# EAGLE design geikoBoard (EAGLE 7.6.0)
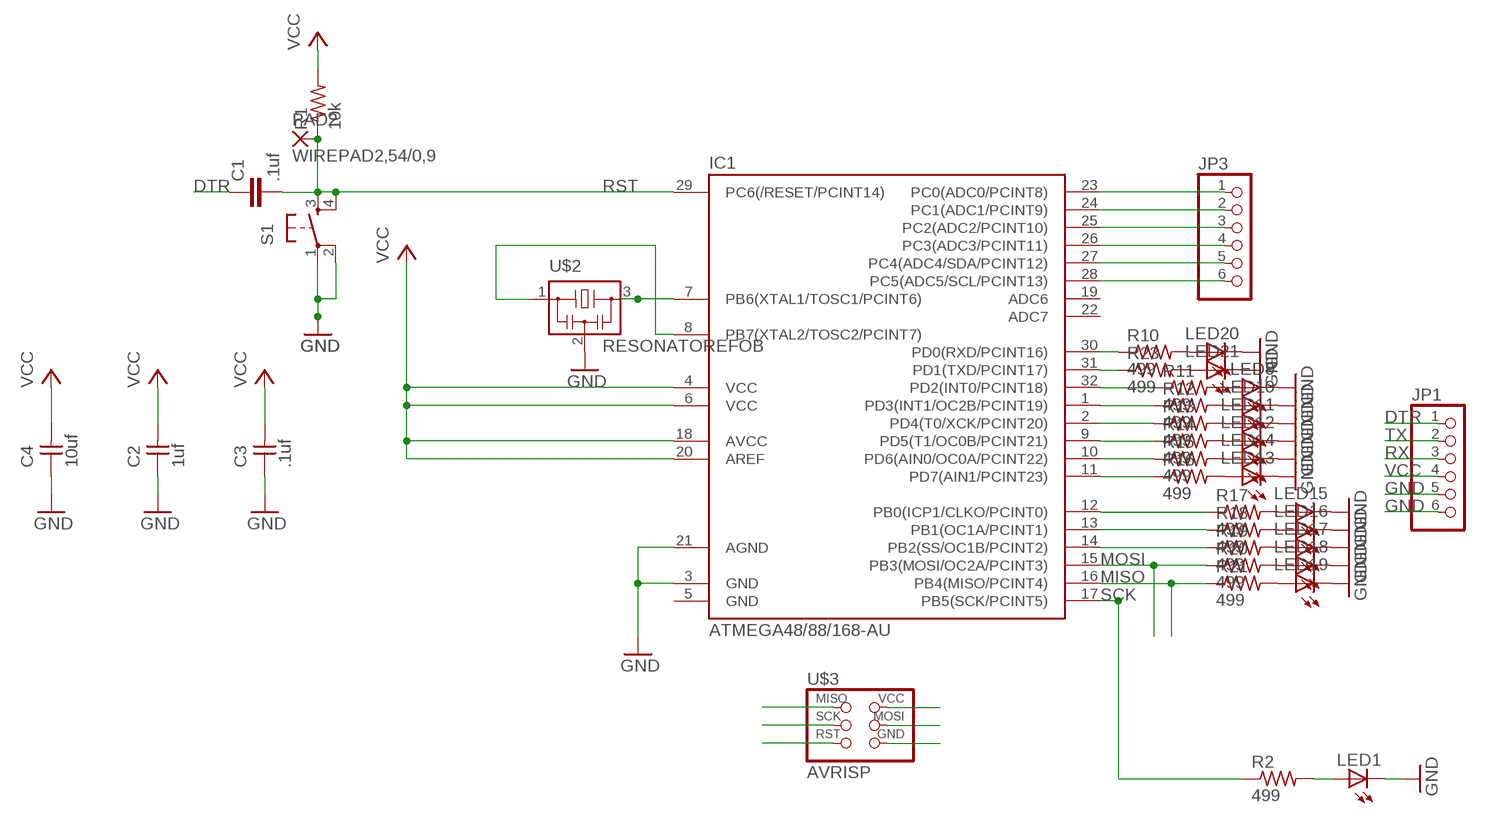
[diagram p0: schematic, sheet 1]

## Parts
C1  .1uf  C-EUC1206  [C1206]
C2  1uf  UNPOLARIZED_CAPACITOR1206  [1206]
C3  .1uf  UNPOLARIZED_CAPACITOR1206  [1206]
C4  10uf  UNPOLARIZED_CAPACITOR1206  [1206]
IC1  ATMEGA48/88/168-AU  [TQFP32-08]
JP1  PINHD-1X6  [1X06]
JP3  PINHD-1X6  [1X06]
LED1  LED5MM  [LED5MM]
LED9  LED1206  [1206]
LED10  LED1206  [1206]
LED11  LED1206  [1206]
LED12  LED1206  [1206]
LED13  LED1206  [1206]
LED14  LED1206  [1206]
LED15  LED1206  [1206]
LED16  LED1206  [1206]
LED17  LED1206  [1206]
LED18  LED1206  [1206]
LED19  LED1206  [1206]
LED20  LED1206  [1206]
LED21  LED1206  [1206]
PAD2  WIREPAD2,54/0,9  [2,54/0,9]
R1  10k  RESISTOR1206  [1206]
R2  499  RESISTOR1206  [1206]
R10  499  RESISTOR1206  [1206]
R11  499  RESISTOR1206  [1206]
R12  499  RESISTOR1206  [1206]
R13  499  RESISTOR1206  [1206]
R14  499  RESISTOR1206  [1206]
R15  499  RESISTOR1206  [1206]
R16  499  RESISTOR1206  [1206]
R17  499  RESISTOR1206  [1206]
R18  499  RESISTOR1206  [1206]
R19  499  RESISTOR1206  [1206]
R20  499  RESISTOR1206  [1206]
R21  499  RESISTOR1206  [1206]
R23  499  RESISTOR1206  [1206]
S1  6MM_SWITCH6MM_SWITCH  [6MM_SWITCH]
U$2  RESONATOREFOB  [EFOBM]
U$3  AVRISP  [2X03]

## Nets
DTR: C1.1 JP1.1
GND: C2.1 C3.1 C4.1 IC1.3(GND) IC1.21(AGND) JP1.5 JP1.6 LED1.K(C) LED9.2(C) LED10.2(C) LED11.2(C) LED12.2(C) LED13.2(C) LED14.2(C) LED15.2(C) LED16.2(C) LED17.2(C) LED18.2(C) LED19.2(C) LED20.2(C) LED21.2(C) S1.1(P) S1.2(P1) U$2.2 U$3.6(GND)
MISO: IC1.16(PB4(MISO/PCINT4)) R21.1 U$3.1(MISO)
MOSI: IC1.15(PB3(MOSI/OC2A/PCINT3)) R20.1 U$3.4(MOSI)
N$1: IC1.8(PB7(XTAL2/TOSC2/PCINT7)) U$2.1
N$2: IC1.12(PB0(ICP1/CLKO/PCINT0)) R17.1
N$3: IC1.23(PC0(ADC0/PCINT8)) JP3.1
N$4: IC1.24(PC1(ADC1/PCINT9)) JP3.2
N$5: IC1.25(PC2(ADC2/PCINT10)) JP3.3
N$6: IC1.26(PC3(ADC3/PCINT11)) JP3.4
N$7: IC1.27(PC4(ADC4/SDA/PCINT12)) JP3.5
N$8: IC1.28(PC5(ADC5/SCL/PCINT13)) JP3.6
N$9: IC1.7(PB6(XTAL1/TOSC1/PCINT6)) U$2.3
N$10: IC1.32(PD2(INT0/PCINT18)) R11.1
N$11: IC1.1(PD3(INT1/OC2B/PCINT19)) R12.1
N$12: IC1.2(PD4(T0/XCK/PCINT20)) R13.1
N$13: IC1.9(PD5(T1/OC0B/PCINT21)) R14.1
N$14: IC1.10(PD6(AIN0/OC0A/PCINT22)) R15.1
N$15: IC1.11(PD7(AIN1/PCINT23)) R16.1
N$17: IC1.13(PB1(OC1A/PCINT1)) R18.1
N$18: IC1.14(PB2(SS/OC1B/PCINT2)) R19.1
N$19: LED9.1(A) R11.2
N$20: LED10.1(A) R12.2
N$21: LED11.1(A) R13.2
N$22: LED12.1(A) R14.2
N$23: LED1.A R2.2
N$24: LED13.1(A) R16.2
N$25: LED14.1(A) R15.2
N$26: LED15.1(A) R17.2
N$27: LED16.1(A) R18.2
N$28: LED17.1(A) R19.2
N$29: LED18.1(A) R20.2
N$30: LED19.1(A) R21.2
N$38: LED20.1(A) R10.2
N$39: LED21.1(A) R23.2
RST: C1.2 IC1.29(PC6(/RESET/PCINT14)) PAD2.1(P) R1.1 S1.3(S) S1.4(S1) U$3.5(RST)
RX: IC1.30(PD0(RXD/PCINT16)) JP1.3 R10.1
SCK: IC1.17(PB5(SCK/PCINT5)) R2.1 U$3.3(SCK)
TX: IC1.31(PD1(TXD/PCINT17)) JP1.2 R23.1
VCC: C2.2 C3.2 C4.2 IC1.4(VCC) IC1.6(VCC) IC1.18(AVCC) IC1.20(AREF) JP1.4 R1.2 U$3.2(VCC)
Unconnected: IC1.19(ADC6) IC1.22(ADC7)

## Power pins joined to a net without a drawn wire
GND: IC1.5(GND)

## Library data of the parts
C1 = rcl:C-EU: CAPACITOR, European symbol
C2-C4 = ng:UNPOLARIZED_CAPACITOR: unpolarized_capacitor
IC1 = atmega8:ATMEGA48/88/168
JP1 JP3 = pinhead:PINHD-1X6: PIN HEADER
LED1 = led:LED: LED OSRAM: - CHIPLED LG R971, LG N971, LY N971, LG Q971, LY Q971, LO R971, LY R971 LH N974, LH R974 LS Q976, LO Q976, LY Q976 LO Q996 - Hyper CHIPLED LW Q18S LB Q993, LB Q99A, LB R99A - SideLED LS A670, LO A670, LY A670, LG A670, LP A670 LB A673, LV A673, LT A673, LW A673 LH A674 LY A675 LS A676, LA A676, LO A676, LY A676, LW A676 LS A679, LY A679, LG A679 - Hyper Micro SIDELED® LS Y876, LA Y876, LO Y876, LY Y876 LT Y87S - SmartLED LW L88C, LW L88S LB L89C, LB L89S, LG L890 LS L89K, LO L89K, LY L89K LS L896, LA L896, LO L896, LY L896 - TOPLED LS T670, LO T670, LY T670, LG T670, LP T670 LSG T670, LSP T670, LSY T670, LOP T670, LYG T670 LG T671, LOG T671, LSG T671 LB T673, LV T673, LT T673, LW T673 LH T674 LS T676, LA T676, LO T676, LY T676, LB T676, LH T676, LSB T676, LW T676 LB T67C, LV T67C, LT T67C, LS T67K, LO T67K, LY T67K, LW E67C LS E67B, LA E67B, LO E67B, LY E67B, LB E67C, LV E67C, LT E67C LW T67C LS T679, LY T679, LG T679 LS T770, LO T770, LY T770, LG T770, LP T770 LB T773, LV T773, LT T773, LW T773 LH T774 LS E675, LA E675, LY E675, LS T675 LS T776, LA T776, LO T776, LY T776, LB T776 LHGB T686 LT T68C, LB T68C - Hyper Mini TOPLED® LB M676 - Mini TOPLED Santana® LG M470 LS M47K, LO M47K, LY M47K Source: http://www.osram.convergy.de LUXEON: - LUMILED® LXK2-PW12-R00, LXK2-PW12-S00, LXK2-PW14-U00, LXK2-PW14-V00 LXK2-PM12-R00, LXK2-PM12-S00, LXK2-PM14-U00 LXK2-PE12-Q00, LXK2-PE12-R00, LXK2-PE12-S00, LXK2-PE14-T00, LXK2-PE14-U00 LXK2-PB12-K00, LXK2-PB12-L00, LXK2-PB12-M00, LXK2-PB14-N00, LXK2-PB14-P00, LXK2-PB14-Q00 LXK2-PR12-L00, LXK2-PR12-M00, LXK2-PR14-Q00, LXK2-PR14-R00 LXK2-PD12-Q00, LXK2-PD12-R00, LXK2-PD12-S00 LXK2-PH12-R00, LXK2-PH12-S00 LXK2-PL12-P00, LXK2-PL12-Q00, LXK2-PL12-R00 Source: www.luxeon.com KINGBRIGHT: KA-3528ASYC Source: www.kingbright.com
LED9-LED21 = ng:LED
PAD2 = wirepad:WIREPAD: Wire PAD connect wire on PCB
R1 R2 R10-R21 R23 = ng:RESISTOR
S1 = ng:6MM_SWITCH: OMRON SWITCH
U$2 = fab:RESONATOR
U$3 = fab:AVRISP

## Board
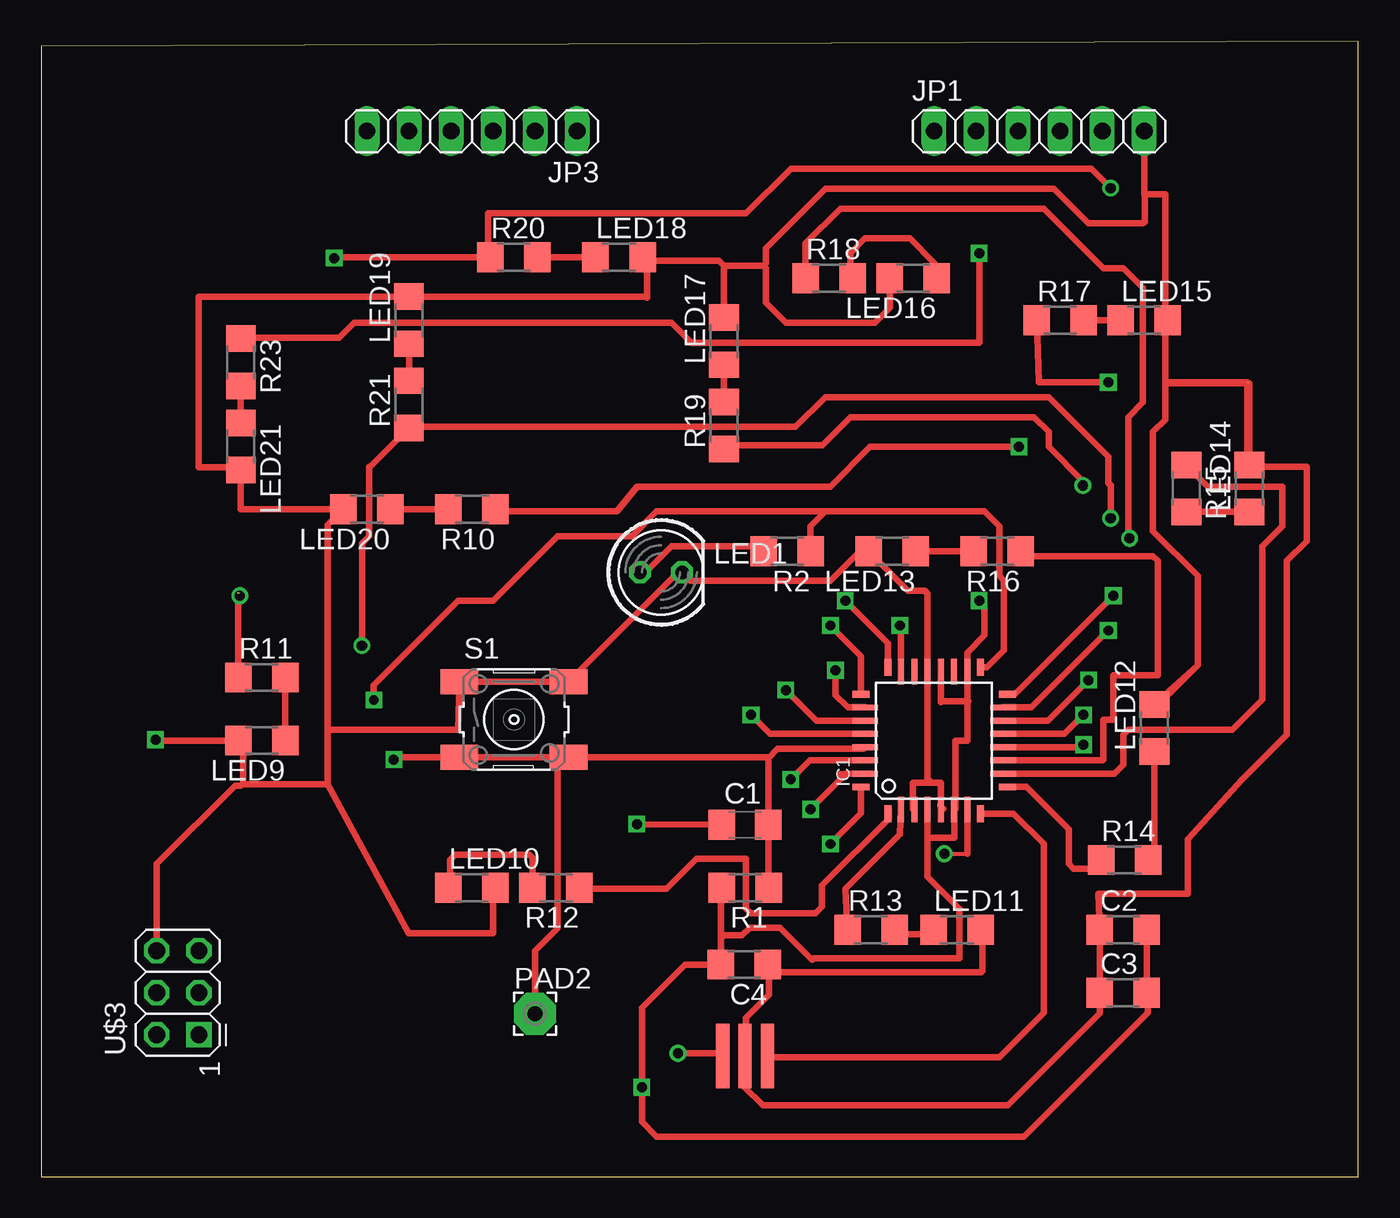
[diagram p1: board, top side]
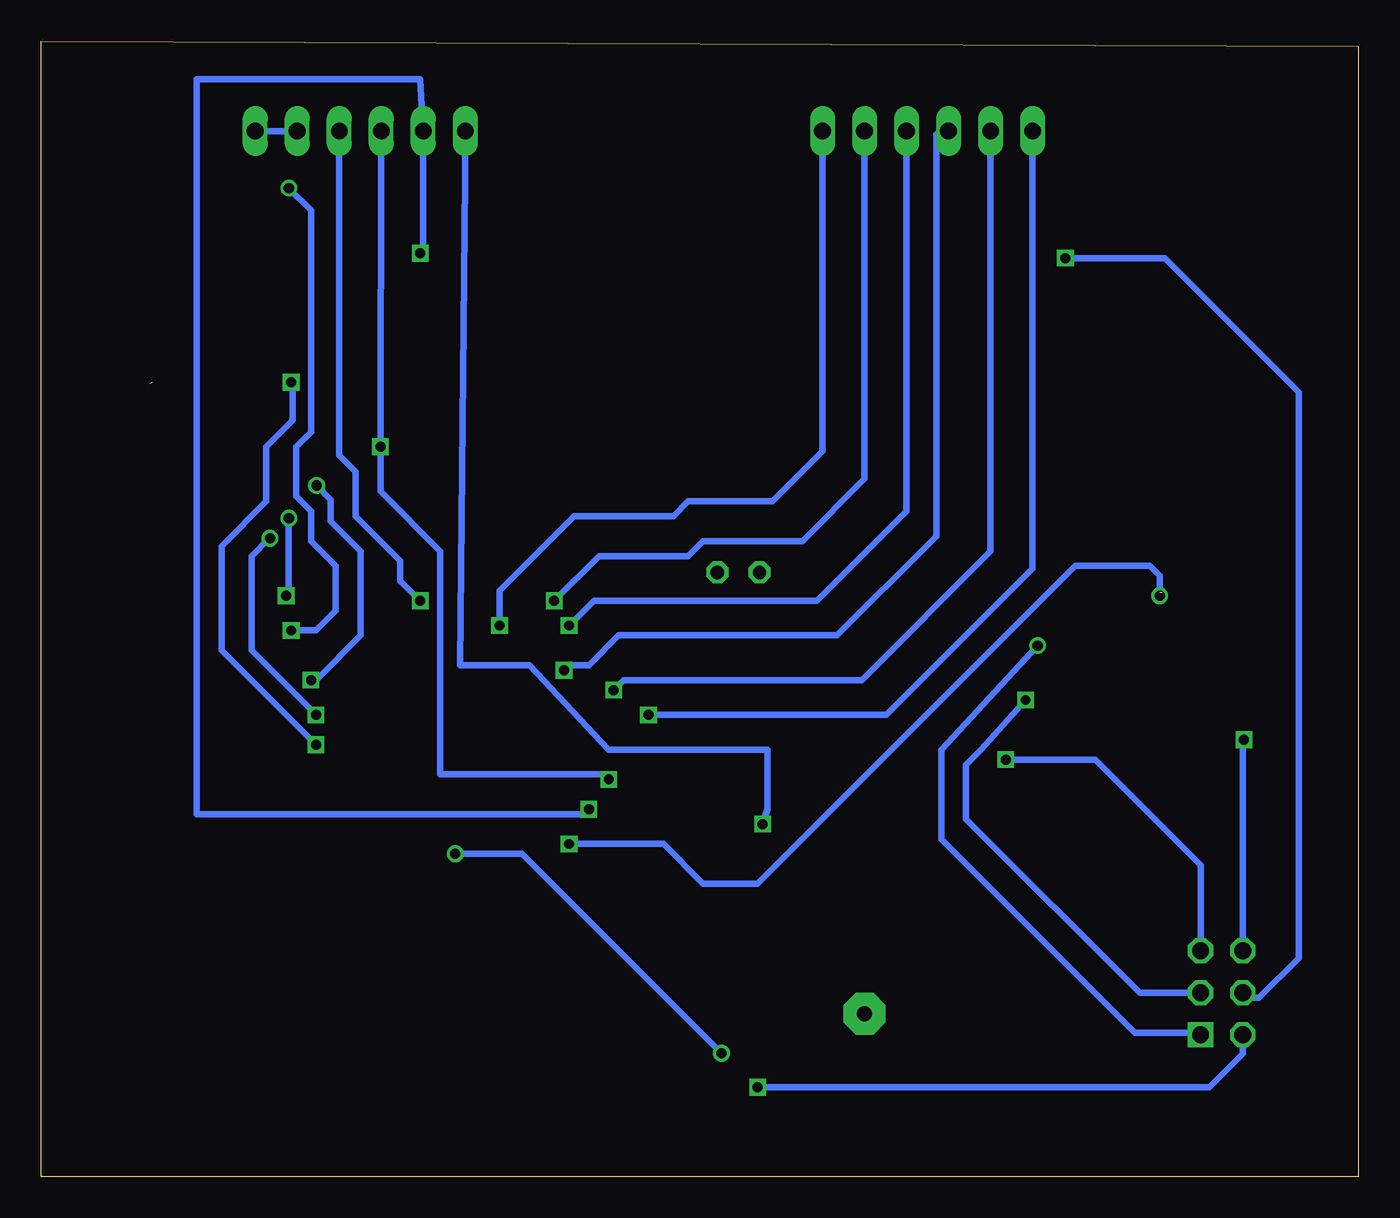
[diagram p2: board, bottom side, seen from below]

Size 79.6 x 68.6 mm. Coordinates in mm from the lower left corner, seen from the top.
Outline: 0,0 79.6,0 79.6,68.6 0,68.3 0,0
Copper layers (1*16): Top 0.035mm / dielectric 1.5mm / Bottom 0.035mm
Design rules "default": minimum track width 10mil, minimum drill 24mil, track to track 8mil, track to pad 8mil, pad to pad 8mil, via to via 8mil, smd to smd 8mil, copper to edge 40mil, drill to drill 8mil, minimum pad ring 10mil, minimum via ring 8mil, stop-mask expansion 4mil, vias tented up to drill 0mil, thermal gap 10mil

### Footprints (pad centres in the part's own frame; a part is rotated, then mirrored left to right if it is on the bottom)
C1206 = smd 1.6 x 1.8: 1 -1.4,0; 2 1.4,0
1206 = smd 1.6 x 1.803: 1 -1.422,0; 2 1.422,0
TQFP32-08 = smd 1.016 x 0.406: 1 -4.42,2.8; 8 -4.42,-2.8; 17 4.42,-2.8; 24 4.42,2.8 | smd 1.524 x 0.356: 2 -4.166,2; 3 -4.166,1.2; 4 -4.166,0.4; 5 -4.166,-0.4; 6 -4.166,-1.2; 7 -4.166,-2; 18 4.166,-2; 19 4.166,-1.2; 20 4.166,-0.4; 21 4.166,0.4; 22 4.166,1.2; 23 4.166,2 | smd 0.406 x 1.016: 9 -2.8,-4.42; 16 2.8,-4.42; 25 2.8,4.42; 32 -2.8,4.42 | smd 0.356 x 1.524: 10 -2,-4.166; 11 -1.2,-4.166; 12 -0.4,-4.166; 13 0.4,-4.166; 14 1.2,-4.166; 15 2,-4.166; 26 2,4.166; 27 1.2,4.166; 28 0.4,4.166; 29 -0.4,4.166; 30 -1.2,4.166; 31 -2,4.166
1X06 = drill 1.016 long: 1 -6.35,0; 2 -3.81,0; 3 -1.27,0; 4 1.27,0; 5 3.81,0; 6 6.35,0
LED5MM = drill 0.813 octagon: A -1.27,0; K 1.27,0
2,54/0,9 = drill 0.914 pad 2.54 octagon: 1 0,0
6MM_SWITCH = smd 2.286 x 1.524: 1 -3.302,2.286; 2 3.302,2.286; 3 -3.302,-2.286; 4 3.302,-2.286
EFOBM = smd 0.8 x 3.9: 1 -1.35,0; 2 0,0; 3 1.35,0
2X03 = drill 1.016 square: 1 -2.54,-1.27 | drill 1.016 octagon: 2 -2.54,1.27; 3 0,-1.27; 4 0,1.27; 5 2.54,-1.27; 6 2.54,1.27

### Placement (x,y rotation side)
C1  42.54,21.27 0 top
C2  65.4,14.92 0 top
C3  65.4,11.11 0 top
C4  42.48,12.82 180 top
IC1  53.97,26.35 90 top
JP1  60.32,63.18 0 top
JP3  26.03,63.18 180 top
LED1  37.46,36.51 0 top
LED9  13.33,26.35 180 top
LED10  26.03,17.46 0 top
LED11  55.35,14.91 0 top
LED12  67.27,27.12 90 top
LED13  51.43,37.78 180 top
LED14  73.02,41.59 90 top
LED15  66.67,51.75 0 top
LED16  52.7,54.29 180 top
LED17  41.27,50.48 90 top
LED18  34.92,55.56 0 top
LED19  22.22,51.75 90 top
LED20  19.68,40.32 180 top
LED21  12.06,44.13 270 top
PAD2  29.84,9.84 0 top
R1  42.54,17.46 180 top
R2  45.08,37.78 180 top
R10  26.03,40.32 180 top
R11  13.33,30.16 0 top
R12  31.11,17.46 180 top
R13  50.16,14.92 0 top
R14  65.47,19.13 0 top
R15  69.21,41.59 270 top
R16  57.78,37.78 180 top
R17  61.59,51.75 0 top
R18  47.62,54.29 0 top
R19  41.27,45.4 90 top
R20  28.57,55.56 0 top
R21  22.22,46.67 90 top
R23  12.06,49.21 270 top
S1  28.57,27.62 0 top
U$2  42.54,7.3 180 top
U$3  8.25,11.11 90 top

### Tracks (layer width: path | path; a pad name or v marks a point on that pad's centre or on a via)
DTR  (via drill 0.6)
  Top 0.406: C1.1 v36,21.3
  Bottom 0.406: JP1.1 54.3,30.9 50.1,30.9 45.3,25.8 35.7,25.8 35.7,22.2 v36,21.3
GND  (1 unrouted)
  Top 0.254: 7.03,13.8 U$3.6 | 12.06,23.63 12.2,23.7 | 66.7,59.29 66.7,59.37
  Top 0.406: 6.98,26.35 LED9.2 | IC1.3 52.7,22.18 52.7,23.81 53.83,23.81 | 53.83,23.81 54.37,23.81 IC1.5 54.48,22.18 54.52,22.23 54.48,22.23 54.39,22.13 54.39,22.36 | LED14.2 73.02,47.94 67.94,47.94 | 67.94,47.94 67.94,51.6 LED15.2 67.94,51.75 67.94,59.37 66.7,59.37 66.67,59.37 JP1.6 | C3.1 C2.1 | C2.1 64.13,14.92 | 54.39,22.36 54.34,22.41 54.34,22.45 | C4.1 43.9,12.42 43.99,12.33 | 43.99,12.33 56.83,12.33 56.9,12.4 56.9,14.78 LED11.2 56.49,14.91 56.4,15 | 17.32,27 17.32,23.7 | 17.32,23.7 12.2,23.7 12.2,26.06 LED9.2 | 11.63,26.07 LED9.2 | C2.1 63.98,9.86 58.42,4.3 43.62,4.3 42.48,5.44 42.48,7.24 U$2.2 42.6,7.36 42.6,9.6 43.99,10.99 43.99,12.33 | 53.83,23.81 53.57,24.07 IC1.21 53.57,35.23 53.4,35.4 52.39,35.4 LED13.2 50.01,37.67 49.94,37.6 49.3,37.6 47.7,36 39.24,36 LED1.K 38.48,36.51 S1.2 S1.1 25.2,27 17.32,27 | LED17.2 41.27,55.04 | 41.27,55.04 40.96,55.35 36.55,55.35 LED18.2 36.6,55.3 36.6,53.1 36.53,53.17 LED19.2 9.52,53.17 9.52,42.86 12.06,42.86 LED21.2 12.06,40.32 LED20.2 17.32,39.38 17.32,27 | 41.27,55.04 43.64,55.04 | 43.64,55.04 43.66,55.04 43.8,54.9 43.8,52.8 45,51.6 50.4,51.6 51.3,52.5 51.3,54.27 LED16.2 | 69.9,30.9 67.54,28.54 LED12.2 69.9,30.9 | 69.9,30.9 69.9,36.3 67.2,39 67.2,45 67.94,45.74 67.94,47.94 | 54.39,22.36 54.39,23.61 54.3,23.7 | 68.1,48 72.9,48 72.9,42.9 76.5,42.9 76.5,38.4 75.3,37.2 75.3,26.7 72.6,24 69.3,20.4 69.3,17.1 63.9,17.1 C2.1 | 17.32,23.7 22.2,14.7 27.3,14.7 27.3,17.31 LED10.2 | 66.7,59.29 66.7,57.7 66.6,57.6 63.3,57.6 61.2,59.7 47.41,59.7 44.11,56.4 44.1,56.4 43.8,56.1 43.8,55.2 43.64,55.04 | 12.06,23.63 11.71,23.63 6.98,18.9 U$3.6
  Bottom 0.406: JP1.6 JP1.5 64.13,62.67 64.2,62.6 | U$3.6 6.98,26.13 7.2,26.35 6.98,26.35
MISO  (via drill 0.6, 0.61)
  Top 0.254: 22.12,45.12 R21.1
  Top 0.406: IC1.16 58.85,29.15 v64.8,35.1 | v19.38,32.09 19.38,38.27 19.8,38.7 19.8,42.9 19.87,42.9 R21.1 22.27,45.3 45.6,45.3 47.4,47.1 60.9,47.1 64.5,43.5 64.5,41.9 64.64,41.76 v64.64,39.79
  Bottom 0.254: 9.32,8.77 U$3.1 | 64.64,35.29 v64.8,35.1
  Bottom 0.406: v19.38,32.09 25.2,25.8 25.2,20.4 13.5,8.7 9.65,8.7 U$3.1 | v64.64,39.79 64.64,35.26 v64.8,35.1
MOSI  (via drill 0.6, 0.61)
  Top 0.406: IC1.15 59.85,28.35 v64.5,33 | v17.7,55.5 17.76,55.56 R20.1 27,55.71 27,58.2 42.6,58.2 45.3,60.9 63.48,60.9 v64.64,59.74
  Bottom 0.254: 63.27,45.01 63.59,44.69 | 64.41,33.01 v64.5,33
  Bottom 0.406: v17.7,55.5 11.7,55.5 3.6,47.4 3.6,13.2 6,10.8 6.67,10.8 U$3.4 | 64.41,33.01 63,33.01 61.8,34.2 61.8,36.9 63.3,38.4 63.3,40.2 64.2,41.1 64.2,44.1 63.61,44.69 63.59,44.69 63.3,44.97 63.3,58.4 v64.64,59.74
N$1
  Top 0.406: 43.81,7.3 U$2.1 43.99,7.2 57.9,7.2 60.6,9.9 60.6,20.1 58.77,21.93 IC1.8
N$2  (via drill 0.6)
  Top 0.406: IC1.12 62.85,25.95 v63,26.1 | R17.1 60.3,48 v64.5,48
  Bottom 0.254: 63.04,26.15 v63,26.1 | 64.41,47.86 v64.5,48
  Bottom 0.406: 64.41,47.86 64.41,45.69 66,44.1 66,40.8 68.7,38.1 68.7,31.8 v63,26.1
N$3  (via drill 0.6)
  Top 0.406: IC1.23 51.97,33.23 v51.9,33.3
  Bottom 0.406: JP3.1 32.38,43.82 35.4,40.8 40.5,40.8 41.4,39.9 47.4,39.9 51.9,35.4 v51.9,33.3
N$4  (via drill 0.6)
  Top 0.406: IC1.24 51.17,32.23 v48.6,34.8
  Bottom 0.406: JP3.2 29.84,42.16 33.6,38.4 39.6,38.4 40.5,37.5 45.9,37.5 v48.6,34.8
N$5  (via drill 0.6)
  Top 0.406: IC1.25 49.55,31.45 v47.7,33.3
  Bottom 0.406: JP3.3 27.3,40.2 32.7,34.8 46.2,34.8 v47.7,33.3
N$6  (via drill 0.6)
  Top 0.406: IC1.26 48.75,28.35 48,29.1 v48,30.6
  Bottom 0.406: JP3.4 25.32,63.18 25.5,63 25.5,38.7 25.8,38.4 31.5,32.7 44.7,32.7 46.5,30.9 47.7,30.9 v48,30.6
N$7  (via drill 0.6)
  Top 0.406: IC1.27 46.85,27.55 v45,29.4
  Bottom 0.406: JP3.5 22.22,37.78 30,30 44.4,30 v45,29.4
N$8  (via drill 0.6)
  Top 0.406: IC1.28 44.05,26.75 v42.9,27.9
  Bottom 0.406: JP3.6 19.68,36.72 28.5,27.9 v42.9,27.9 43.05,27.75
N$9  (via drill 0.61)
  Top 0.254: v54.58,19.52 55.97,19.52
  Top 0.406: IC1.7 55.97,19.52 | v38.48,7.45 41.05,7.45 U$2.3
  Bottom 0.406: v38.48,7.45 50.55,19.52 v54.58,19.52
N$10  (via drill 0.6)  (2 unrouted)
  Top 0.406: IC1.32 49.55,21.95 v47.7,20.1 | R11.1 11.91,35.2 12,35.29
  Bottom 0.406: v47.7,20.1 42,20.1 39.6,17.7 36.3,17.7 17.1,36.9 12.6,36.9 12,36.3 12,35.29
N$11
  Top 0.406: IC1.1 51.17,22.09 51.24,22.16 51.24,21.64 47.2,17.6 47.2,16.3 46.8,15.9 42.9,15.9 42.6,16.2 42.6,19.2 39.6,19.2 37.8,17.4 32.59,17.4 R12.1
N$12
  Top 0.406: R13.1 48.6,17.4 51.9,20.7 IC1.2
N$13
  Top 0.406: IC1.9 59.55,23.55 62.1,21 62.1,18.9 62.4,18.6 63.52,18.6 R14.1
N$14
  Top 0.406: IC1.10 64.85,24.35 65.4,24.9 65.4,26.7 65.7,27 72,27 73.8,28.8 73.8,38.1 75,39.3 75,41.7 70.52,41.7 R15.1
N$15
  Top 0.406: IC1.11 64.15,25.15 64.2,25.2 64.2,27.6 64.8,27.6 64.8,30.3 67.5,30.3 67.5,37.2 67.2,37.5 59.48,37.5 R16.1
N$17  (via drill 0.6, 0.61)
  Top 0.406: IC1.13 61.85,26.75 v63,27.9 | R18.1 46.2,56.1 46.2,56.4 48.3,58.5 60.6,58.5 64.2,54.9 65.4,54.9 66.6,53.7 66.6,46.8 65.7,45.9 65.7,38.66 v65.78,38.58
  Bottom 0.254: 65.78,30.72 63.04,27.98 v63,27.9
  Bottom 0.406: v65.78,38.58 65.82,38.58 66.9,37.5 66.9,31.8 v63,27.9
N$18  (via drill 0.6, 0.61)
  Top 0.254: 41.32,44.21 R19.1
  Top 0.406: IC1.14 60.85,27.55 v63.3,30 | 41.32,44.21 47.21,44.21 48.9,45.9 60,45.9 60.9,45 60.9,44.1 62.97,42.03 v62.97,41.76
  Bottom 0.254: 63.27,30.03 v63.3,30
  Bottom 0.406: 63.27,30.03 62.97,30.03 60.3,32.7 60.3,37.8 62.1,39.6 62.1,40.9 v62.97,41.76
N$19
  Top 0.406: R11.2 LED9.1
N$20
  Top 0.406: R12.2 29.69,19.26 29.5,19.45 25,19.45 24.7,19.15 24.7,17.55 LED10.1
N$21
  Top 0.406: R13.2 51.86,14.92 51.86,14.65 53.67,14.65 LED11.1
N$22
  Top 0.406: LED12.1 67.27,19.51 R14.2
N$23
  Top 0.406: LED1.A 36.51,36.51 38.1,38.1 43.34,38.1 R2.2
N$24
  Top 0.406: R16.2 LED13.1
N$25
  Top 0.406: LED14.1 R15.2
N$26
  Top 0.406: R17.2 LED15.1
N$27
  Top 0.406: LED16.1 54.01,54.29 54,54.3 54,55.2 52.5,56.7 49.8,56.7 48.9,55.8 48.9,54.43 R18.2
N$28
  Top 0.406: LED17.1 R19.2
N$29
  Top 0.406: LED18.1 R20.2
N$30
  Top 0.406: LED19.1 R21.2
N$36  (via drill 0.6)
  other vias: 21.3,25.2
N$37  (via drill 0.6)
  other vias: 6.9,26.4
N$38
  Top 0.406: LED20.1 R10.2
N$39
  Top 0.406: LED21.1 R23.2
N$41  (via drill 0.6)
  other vias: 12,35.1
RST  (1 unrouted)
  Top 0.406: S1.4 S1.3 21.2,25.33 | R1.1 43.96,21.25 C1.2 43.94,25.28 | 43.94,25.28 44.51,25.85 49.7,25.85 IC1.29 | S1.4 43.89,25.33 43.94,25.28 | PAD2.1 29.84,13.64 31.05,14.85 31.2,15 31.2,24.66 S1.4
  Bottom 0.406: U$3.5 9.52,18.82 15.9,25.2 21.07,25.2 21.2,25.33
RX  (via drill 0.6)
  Top 0.406: IC1.30 46.45,25.15 v45.3,24 | v59.1,44.1 50.1,44.1 47.7,41.7 36,41.7 34.8,40.2 27.57,40.2 R10.1
  Bottom 0.406: JP1.3 v59.1,44.1 59.1,41.4 55.5,37.8 55.5,24.3 45.6,24.3 v45.3,24
SCK  (via drill 0.6)
  Top 0.406: IC1.17 57.17,30.77 58.2,31.8 58.2,36 57.9,36.3 57.9,39.3 57,40.2 47.4,40.2 | 46.5,39.3 R2.1 46.5,39.3 | 46.5,39.3 47.4,40.2 | 47.4,40.2 37.2,40.2 35.7,38.7 31.2,38.7 27.3,34.8 25.2,34.8 20.1,29.7 v20.1,28.8
  Bottom 0.406: v20.1,28.8 22.8,25.8 23.7,24.9 23.7,21.6 13.2,11.1 U$3.3
TX  (via drill 0.6)
  Top 0.406: v46.5,22.2 48.65,24.35 IC1.31 48.3,24.3 | v56.7,55.8 56.7,50.4 39.3,50.4 38.1,51.6 18.9,51.6 18,50.7 12.13,50.7 R23.1
  Bottom 0.406: v46.5,22.2 46.8,21.9 70.2,21.9 70.2,66.3 56.7,66.3 JP1.2 56.51,55.99 v56.7,55.8
VCC  (via drill 0.6)
  Top 0.406: IC1.18 55.97,26.35 55.24,26.35 55.24,22.18 IC1.6 55.21,22.15 55.21,20.49 53.66,20.49 53.57,20.57 | C2.2 C3.2 66.9,11.03 66.9,9.9 59.4,2.4 37.2,2.4 36.3,3.3 v36.3,5.4 36.3,10.2 38.92,12.82 C4.2 41.09,12.85 41.09,14.4 | IC1.4 53.57,20.57 | R1.2 41.12,17.3 41.09,17.28 41.09,14.4 | 53.57,20.57 53.57,18.13 55.5,16.2 55.5,13.2 46.69,13.2 46.58,13.09 44.64,15.03 42.82,15.03 42.37,14.57 41.27,14.57 41.09,14.4 | IC1.18 55.97,28.78 56.03,28.72 54.43,28.72 54.39,28.68 54.39,30.5 IC1.20 | IC1.18 55.97,31.67 57,32.7 57,34.5 v56.7,34.8
  Bottom 0.406: U$3.2 6.98,7.42 9,5.4 v36.3,5.4 | JP1.4 61.59,43.59 60.6,42.6 60.6,39.9 57.9,37.2 57.9,36 v56.7,34.8